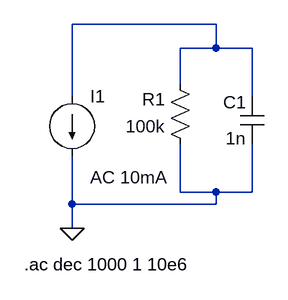
[diagram p0: schematic raw_rc.asc]
raw_rc.asc, the LTspice schematic file:
Version 4
SHEET 1 880 680
WIRE 240 0 48 0
WIRE 240 32 240 0
WIRE 240 32 192 32
WIRE 288 32 240 32
WIRE 192 80 192 32
WIRE 48 96 48 0
WIRE 288 96 288 32
WIRE 192 224 192 160
WIRE 240 224 192 224
WIRE 288 224 288 160
WIRE 288 224 240 224
WIRE 48 240 48 176
WIRE 240 240 240 224
WIRE 240 240 48 240
WIRE 48 272 48 240
FLAG 48 272 0
SYMBOL cap 304 160 R180
WINDOW 0 24 56 Left 2
WINDOW 3 24 8 Left 2
SYMATTR InstName C1
SYMATTR Value 1n
SYMBOL res 208 176 R180
WINDOW 0 36 76 Left 2
WINDOW 3 36 40 Left 2
SYMATTR InstName R1
SYMATTR Value 100k
SYMBOL current 48 96 R0
WINDOW 123 24 108 Left 2
WINDOW 39 0 0 Left 2
SYMATTR InstName I1
SYMATTR Value ""
SYMATTR Value2 AC 10mA
TEXT -16 320 Left 2 !.ac dec 1000 1 10e6

The netlist it stands for:
* raw_rc.asc
C1 0 N001 1n
R1 0 N001 100k
I1 N001 0 AC 10mA
.ac dec 1000 1 10e6
.backanno
.end